# Altium schematic sheet TCAN1146_PINOUT.SchDoc
size A4; SheetNumber: 9; SheetTotal: 9
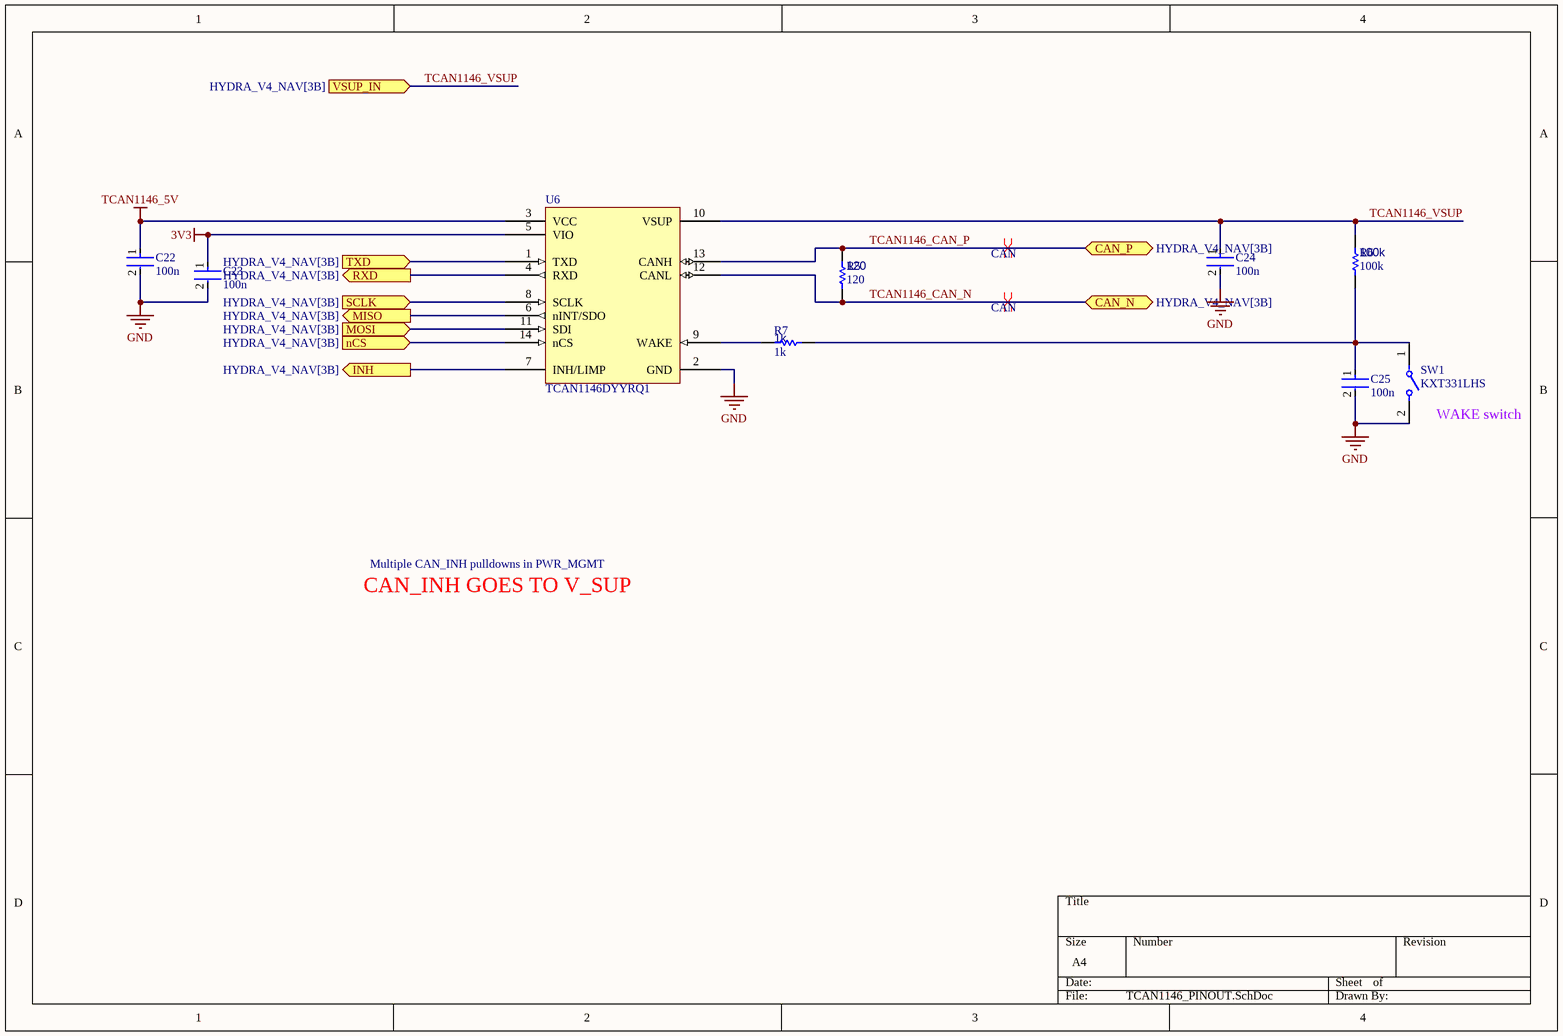
[diagram p0: TCAN1146_PINOUT.SchDoc]

## Parts
C22  100n  [FP-0402-L_1_0_0_05-W_0_5-IPC_A]
C23  100n  [FP-0402-L_1_0_0_05-W_0_5-IPC_A]
C24  100n  [FP-0402-L_1_0_0_05-W_0_5-IPC_A]
C25  100n  [FP-0402-L_1_0_0_05-W_0_5-IPC_A]
R5  120  [R0603B]
R6  100k  [R0603B]
R7  1k  [R0603B]
SW1  KXT331LHS  [FP-KXT331LHS-MFG]
U6  TCAN1146DYYRQ1  [TCAN1146DYYRQ1-Footprint-1]

## Ports
CAN_N (bidir, see HYDRA_V4_NAV[3B]), CAN_P (bidir, see HYDRA_V4_NAV[3B]), INH (out, see HYDRA_V4_NAV[3B]), MISO (out, see HYDRA_V4_NAV[3B]), MOSI (in, see HYDRA_V4_NAV[3B]), nCS (in, see HYDRA_V4_NAV[3B]), RXD (out, see HYDRA_V4_NAV[3B]), SCLK (in, see HYDRA_V4_NAV[3B]), TXD (in, see HYDRA_V4_NAV[3B]), VSUP_IN (in, see HYDRA_V4_NAV[3B])

## Nets
3V3: C23.1 U6.5(VIO)
GND: C22.2 C23.2 C24.2 C25.2 SW1.2 U6.2(GND)
TCAN1146_5V: C22.1 U6.3(VCC)
INH: U6.7(INH/LIMP) ; port INH
MISO: U6.6(nINT/SDO) ; port MISO
MOSI: U6.11(SDI) ; port MOSI
nCS: U6.14(nCS) ; port nCS
RXD: U6.4(RXD) ; port RXD
SCLK: U6.8(SCLK) ; port SCLK
TCAN1146_CAN_N: R5.1 U6.12(CANL) ; port CAN_N
TCAN1146_CAN_P: R5.2 U6.13(CANH) ; port CAN_P
TCAN1146_VSUP: C24.1 R6.2 U6.10(VSUP) ; port VSUP_IN
TXD: U6.1(TXD) ; port TXD
NetC25_1: C25.1 R6.1 R7.1 SW1.1
NetR7_2: R7.2 U6.9(WAKE)

## Layout directives
differential pair; differential pair class CAN: TCAN1146_CAN_N, TCAN1146_CAN_P

## Notes on the sheet
- (near SW1) WAKE switch
- Multiple CAN_INH pulldowns in PWR_MGMT
- CAN_INH GOES TO V_SUP

## Library data of the parts
C22-C25 = CMP-001-00058-1: LARGE PADS, 0402 CAP, CHANGE COMMENT TO MATCH REAL P/N; Capacitor Type: Ceramic; Value: 100n; Min Operating Temperature: -55°C; Mounting Technology: Surface Mount; Pins: 2; Case/Package: 0402; RoHS Compliant: Yes; Max Operating Temperature: 85°C
R5-R7 = CMP-009-00002-14: Resistor
  R5: Value: 120
  R6: Value: 100k
  R7: Value: 1k
SW1 = CMP-10040-000029-1: SWITCH TACTILE SPST-NO 0.02A 15V; Operating Force: 240gf; Switch Travel: 0.13mm; Illumination Type: Non-Illuminated; Throw Configuration: SPST; Number of Ports: 1; Current Rating: 5A; Mechanical Life: 500000Cycles; Switch Function: Off-Mom; Connector Type: USB; Actuator Type: Standard; Gender: Receptacle; Number of Contacts: 24; Contact Plating: Gold; Insulation Color: Black; Min Operating Temperature: -40°C; Packaging: Tape and Reel; Flammability Rating: UL94 V-0; Max Operating Temperature: 85°C; Termination: Solder; Mount: Surface Mount
U6 = CMP-318-000000-2: Automotive CAN FD transceiver with watchdog, bus diagnostics and partial networking via sele 14-SOT-23-THIN -40 to 150; Component Type: Standard; Design Item ID: CMP-015-00012-2; Pin Count: 14; Source: TCAN1146DYYRQ1.SchLib